# EAGLE design Shruthi-Analog-template-v02 (EAGLE 9.6.2)
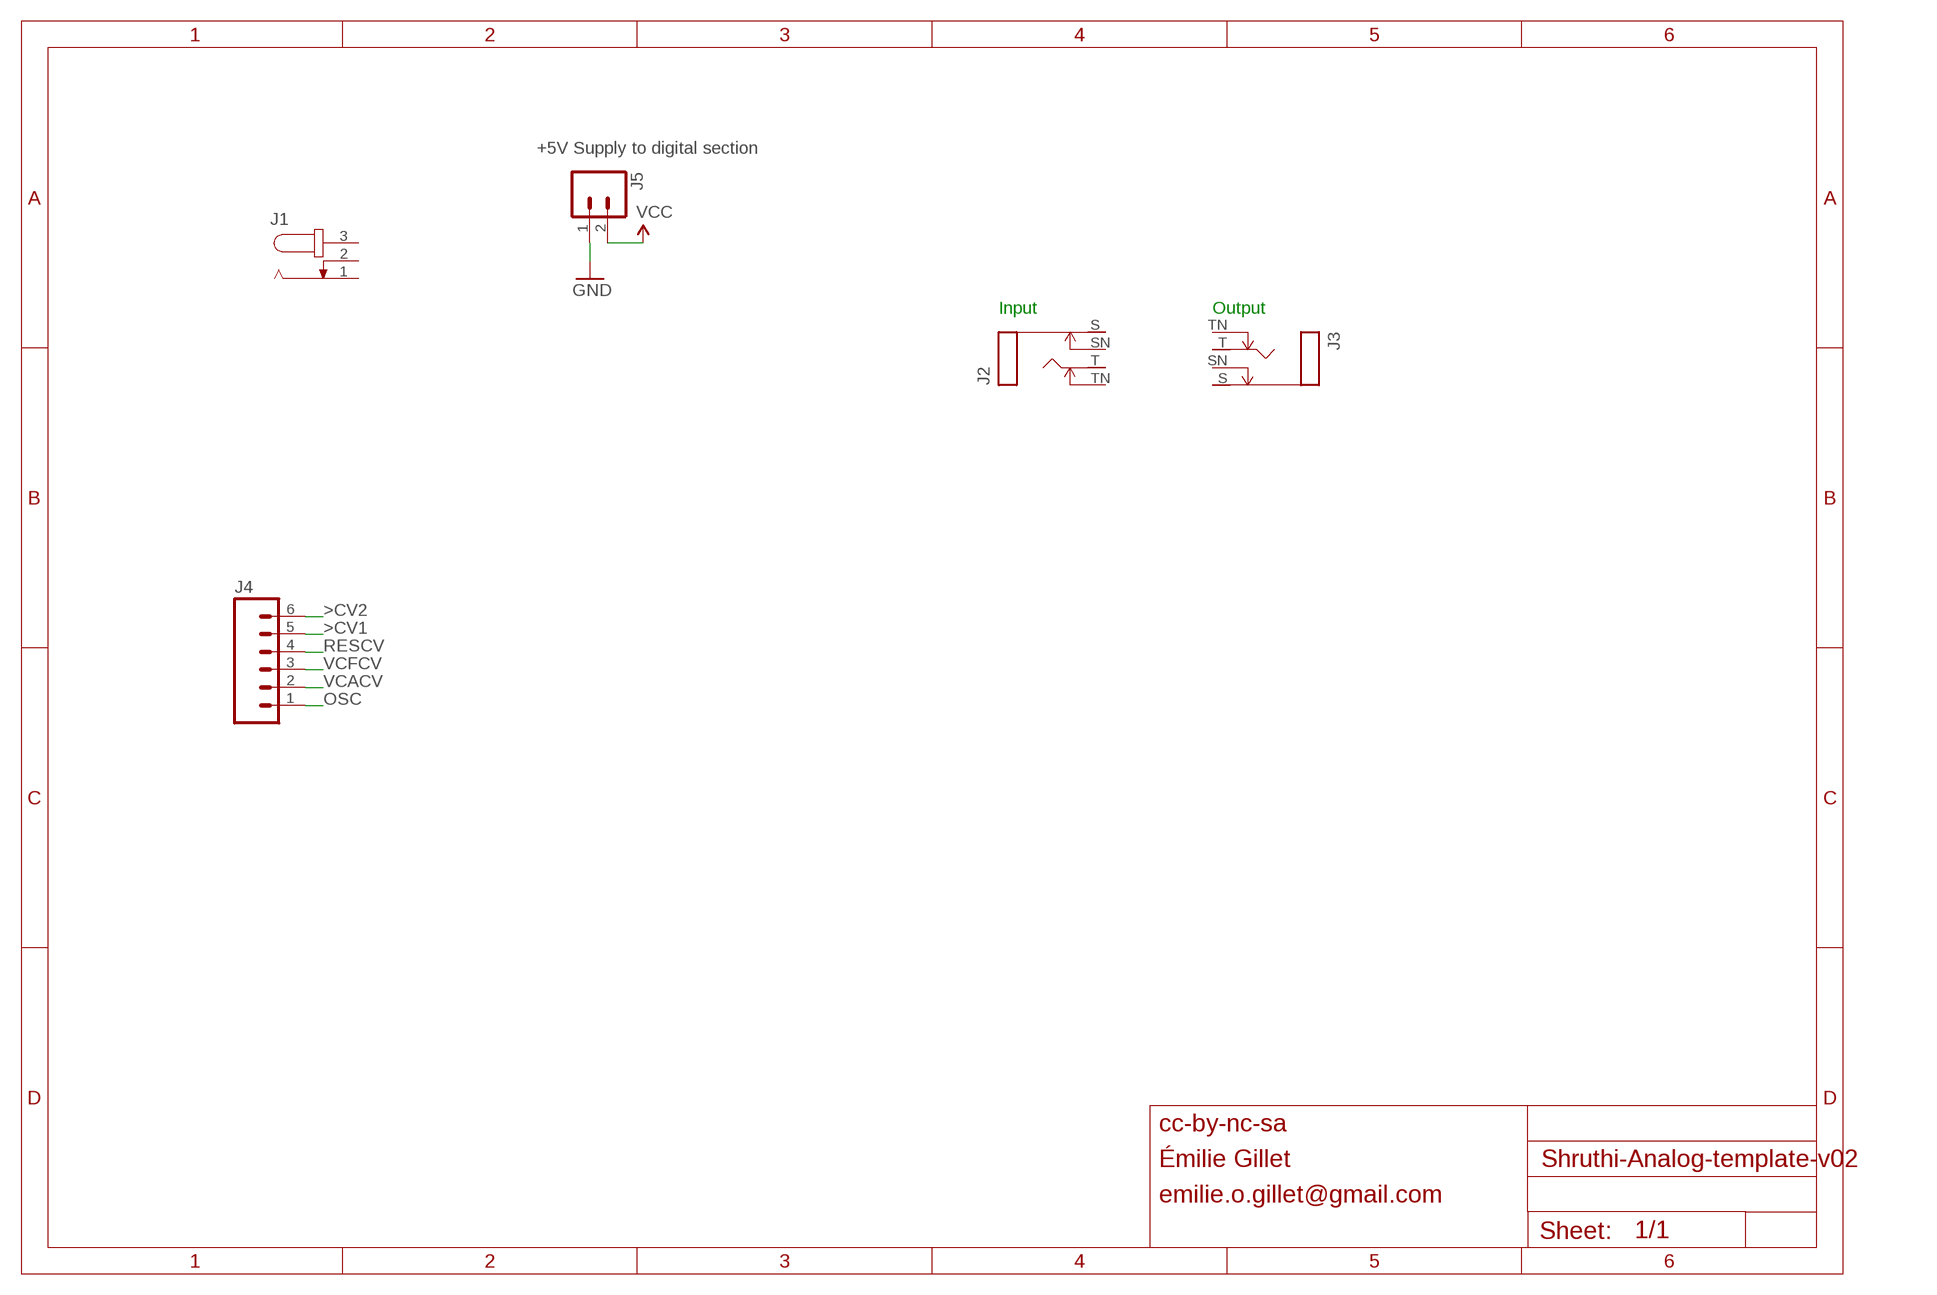
[diagram p0: schematic, sheet 1]

## Parts
J1  JACK-PLUG  [SPC4078_LARGER_HOLES]
J2  MONOSWS  [NMJ4HC-S]
J3  MONOSWS  [NMJ4HC-S]
J4  M06SIP  [1X06]
J5  M02PTH  [1X02]

## Nets
>CV1: J4.5
>CV2: J4.6
GND: J5.1
OSC: J4.1
RESCV: J4.4
VCACV: J4.2
VCC: J5.2
VCFCV: J4.3
Unconnected: J1.1 J1.2 J1.3 J2.S J2.SN J2.T J2.TN J3.S J3.SN J3.T J3.TN

## Notes on the sheet
- +5V Supply to digital section
- Input | Output
- cc-by-nc-sa
- Émilie Gillet
- emilie.o.gillet@gmail.com

## Library data of the parts
J1 = con-jack2:JACK-PLUG: DC POWER JACK Power Jack, DC, Right Angle, Through Hole, Rated 5A at 16VDC, PC Terminals Distributor: Farnell (www.Farnell.de) Drawing: 84N1161.pdf / 84N1162.pdf Manufacturer: SPC Technology (www.spctechnology.com) Type: SPC4077 / SPC 4078
J2 J3 = gm-jacks:MONOSW
J4 = SparkFun:M06: Header 6 Standard 6-pin 0.1" header. Use with straight break away headers (SKU : PRT-00116), right angle break away headers (PRT-00553), swiss pins (PRT-00743), machine pins (PRT-00117), and female headers (PRT-00115). Molex polarized connector foot print use with SKU : PRT-08094 with associated crimp pins and housings. NOTES ON THE VARIANTS LOCK and LOCK_LONGPADS... This footprint was designed to help hold the alignment of a through-hole component (i.e. 6-pin header) while soldering it into place. You may notice that each hole has been shifted either up or down by 0.005 of an inch from it's more standard position (which is a perfectly straight line). This slight alteration caused the pins (the squares in the middle) to touch the edges of the holes. Because they are alternating, it causes a "brace" to hold the component in place. 0.005 has proven to be the perfect amount of "off-center" position when using our standard breakaway headers. Although looks a little odd when you look at the bare footprint, once you have a header in there, the alteration is very hard to notice. Also, if you push a header all the way into place, it is covered up entirely on the bottom side. This idea of altering the position of holes to aid alignment will be further integrated into the Sparkfun Library for other footprints. It can help hold any component with 3 or more connection pins.
J5 = SparkFun:M02: Header 2 Standard 2-pin 0.1" header. Use with straight break away headers (SKU : PRT-00116), right angle break away headers (PRT-00553), swiss pins (PRT-00743), machine pins (PRT-00117), and female headers (PRT-00115). Molex polarized connector foot print use with SKU : PRT-08233 with associated crimp pins and housings.

## Board
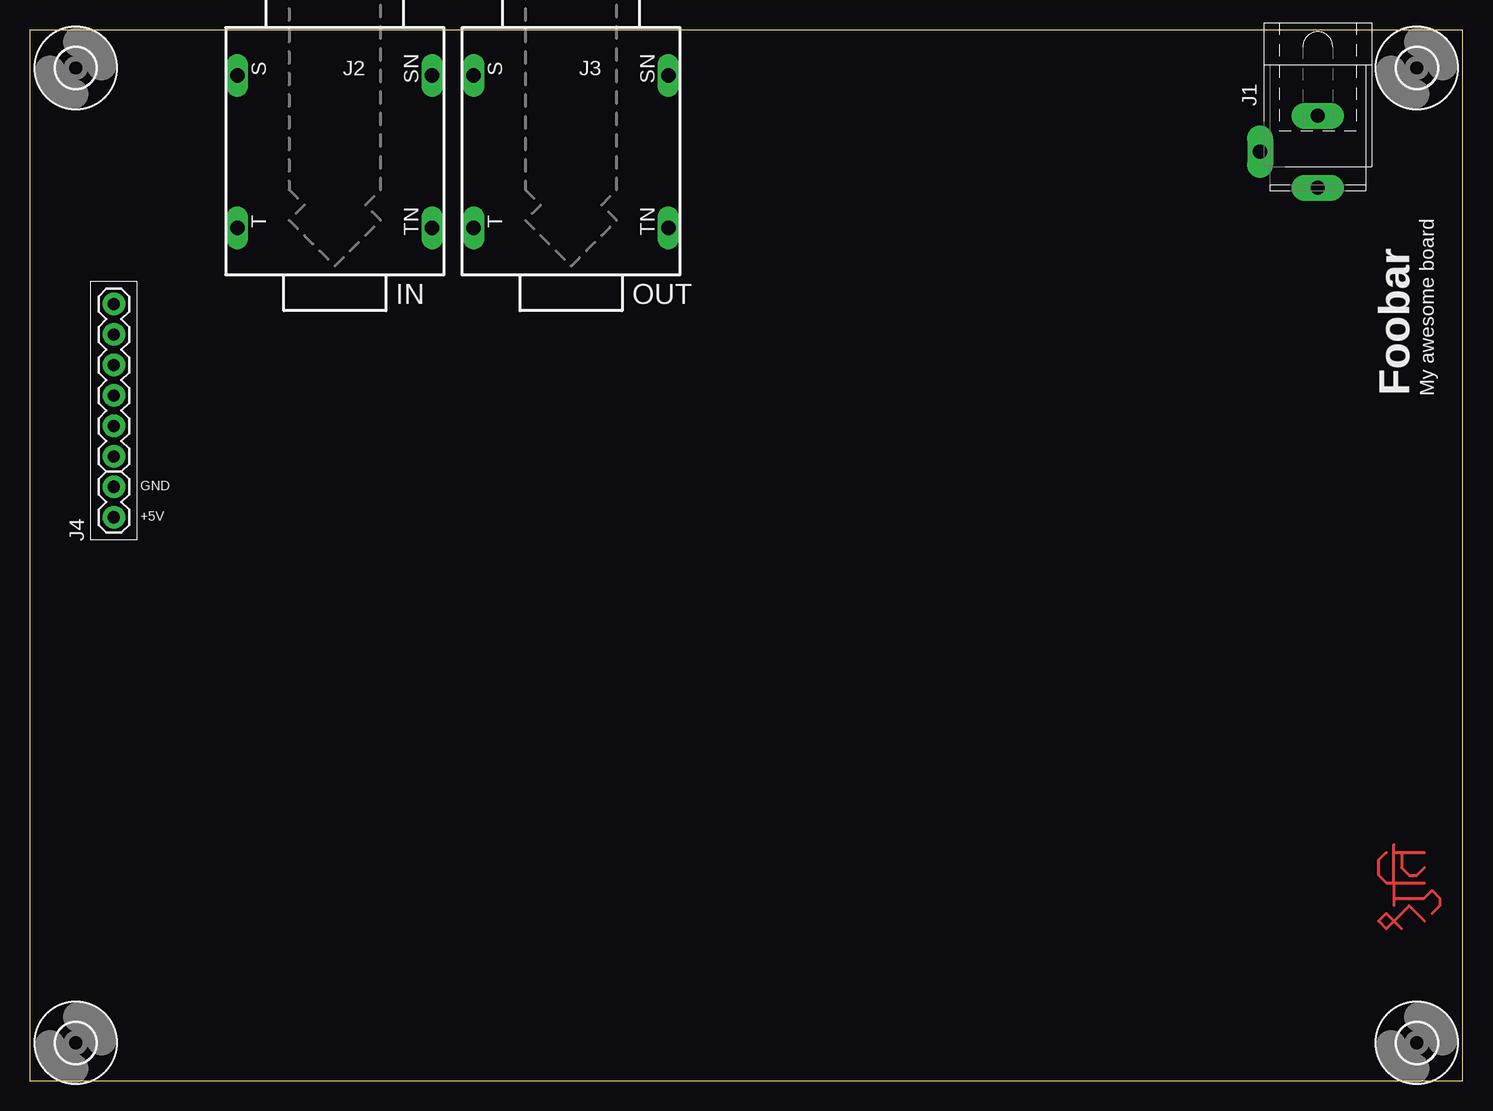
[diagram p1: board, top side]
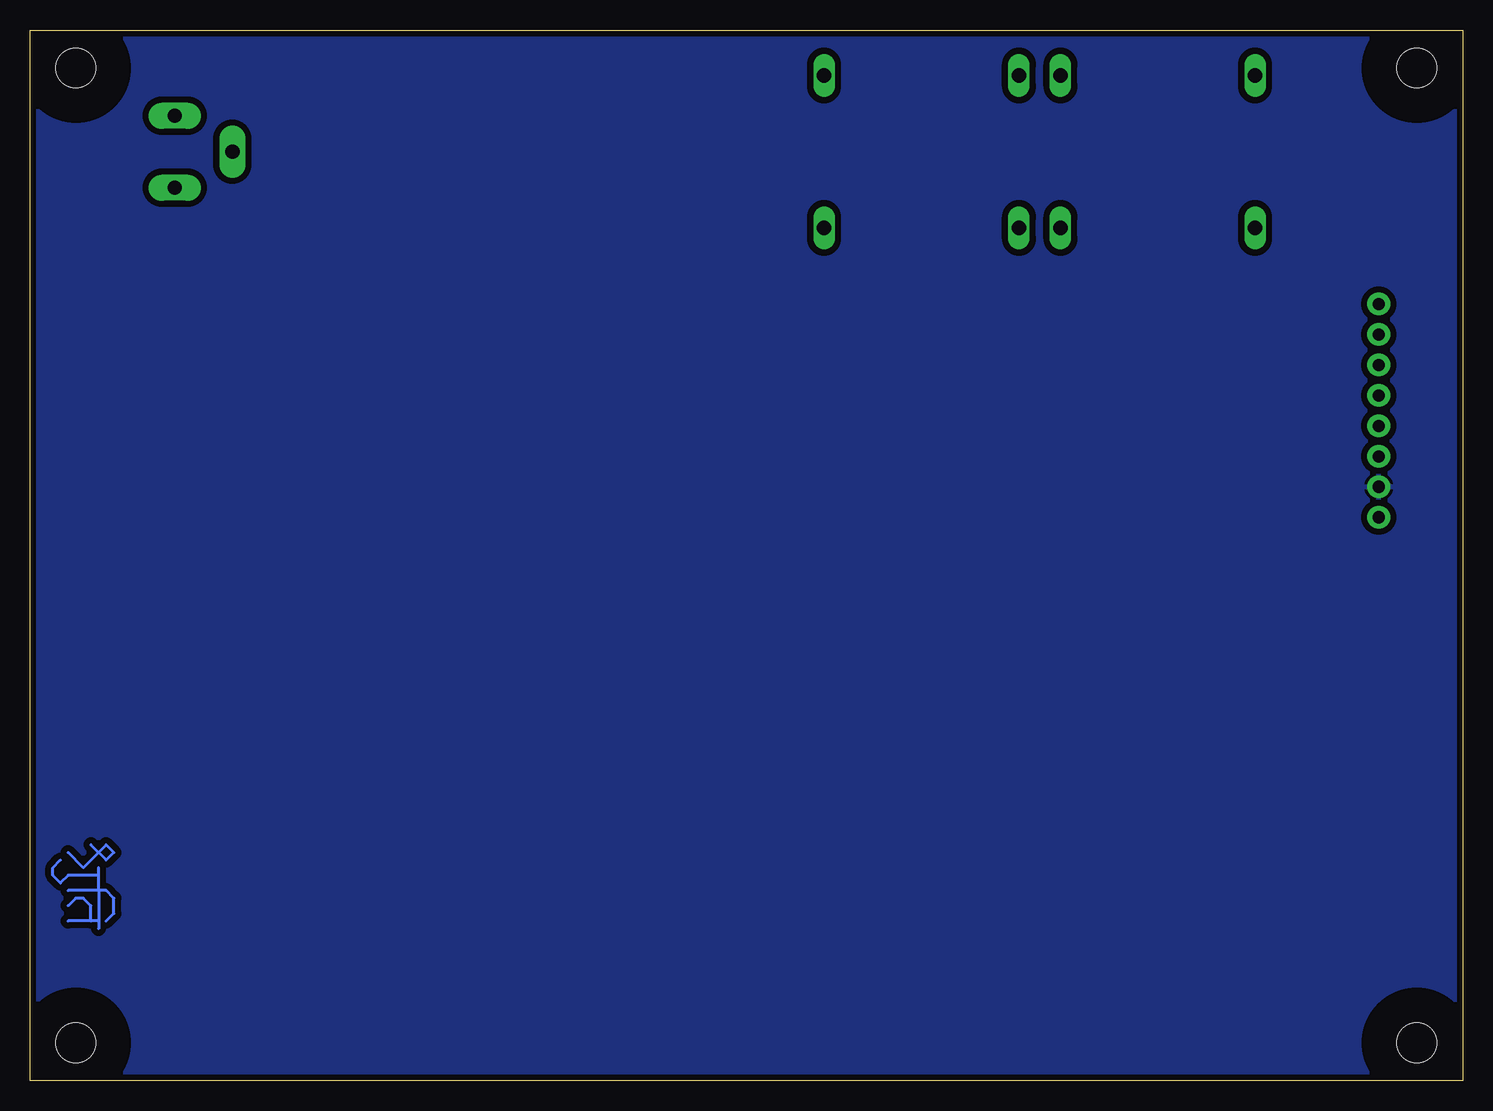
[diagram p2: board, bottom side, seen from below]

Size 119.38 x 87.62 mm. Coordinates in mm from the lower left corner, seen from the top.
Outline: 0,0 119.38,0 119.38,87.62 0,87.62 0,0
Copper layers (1*16): Top 0.035mm / dielectric 1.5mm / Bottom 0.035mm
Design rules "SparkFun_10mil": minimum track width 10mil, minimum drill 20mil, track to track 10mil, track to pad 10mil, pad to pad 10mil, via to via 10mil, smd to smd 10mil, copper to edge 10mil, drill to drill 10mil, minimum pad ring 12mil, minimum via ring 10mil, stop-mask expansion 4mil, vias tented up to drill 25mil, thermal gap 10mil

### Footprints (pad centres in the part's own frame; a part is rotated, then mirrored left to right if it is on the bottom)
SPC4078_LARGER_HOLES = drill 1.2 pad 2.184 long: 1 -3,0; 2 0,-4.8; 3 3,0
NMJ4HC-S = drill 1.2 long: S 5.08,8.115; SN 5.08,-8.115; T -7.62,8.115; TN -7.62,-8.115
1X06 = drill 1.016 pad 1.88: 1 0,0; 2 2.54,0; 3 5.08,0; 4 7.62,0; 5 10.16,0; 6 12.7,0
1X02 = drill 1.016 pad 1.88: 1 0,0; 2 2.54,0
3,3 = hole 3.3: 0,0

### Placement (x,y rotation side)
J1  107.31,77.47 270 top
J2  25.4,78.74 90 top
J3  45.09,78.74 90 top
J4  6.99,52.07 90 top
J5  6.99,49.53 270 top
U$1  [3,3]  3.81,84.46 0 top
U$2  [3,3]  115.57,84.46 0 top
U$5  [3,3]  3.81,3.17 0 top
U$6  [3,3]  115.57,3.17 0 top

### Tracks (layer width: path | path; a pad name or v marks a point on that pad's centre or on a via)
GND
  pour Bottom (isolate 0.508): 0.64,87 0.64,0.64 118.75,0.64 118.75,87
N$15
  Bottom 0.254: 116.2,19.05 114.94,17.78 113.03,19.68 112.39,19.05 113.03,18.41 114.3,19.68
N$52
  Bottom 0.254: 113.67,17.14 113.67,17.78 | 113.67,15.88 113.67,17.14 | 113.67,15.88 113.67,13.34 | 113.67,13.34 113.67,12.7 | 114.3,13.34 116.2,13.34 | 113.67,13.34 114.3,13.34 | 114.3,13.34 114.3,14.61 114.94,15.24 115.57,15.24 116.2,14.61 | 113.67,17.14 116.2,17.14 116.84,16.51 117.47,17.14 117.47,17.78 116.84,18.41 | 113.67,15.88 116.2,15.88 | 113.67,15.88 113.03,15.88 112.39,15.24 112.39,13.97 113.03,13.34
N$53
  Top 0.254: 116.2,13.34 114.94,14.61 113.03,12.7 112.39,13.34 113.03,13.97 114.3,12.7
N$54
  Top 0.254: 113.67,15.24 113.67,14.61 | 113.67,16.51 113.67,15.24 | 113.67,16.51 113.67,19.05 | 113.67,19.05 113.67,19.68 | 114.3,19.05 116.2,19.05 | 113.67,19.05 114.3,19.05 | 114.3,19.05 114.3,17.78 114.94,17.14 115.57,17.14 116.2,17.78 | 113.67,15.24 116.2,15.24 116.84,15.88 117.47,15.24 117.47,14.61 116.84,13.97 | 113.67,16.51 116.2,16.51 | 113.67,16.51 113.03,16.51 112.39,17.14 112.39,18.41 113.03,19.05

### Text on the board
tPlace: GND | +5V
tNames: IN | OUT | Foobar | My awesome board